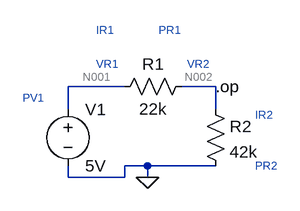
[diagram p0: schematic Draft14.asc]
Draft14.asc, the LTspice schematic file:
Version 4
SHEET 1 880 680
WIRE 176 96 96 96
WIRE 304 96 256 96
WIRE 96 128 96 96
WIRE 304 128 304 96
WIRE 208 208 176 208
WIRE 304 208 208 208
WIRE 96 224 96 208
WIRE 176 224 176 208
WIRE 176 224 96 224
WIRE 208 224 208 208
FLAG 208 224 0
DATAFLAG 288 96 "round(V(n002)*100)/100"
DATAFLAG 416 176 "round(I(R2)*100000)/100000"
DATAFLAG 384 240 "round(I(R2)*V(n002)*10000)/10000"
DATAFLAG 160 96 "(round(($-V(n002))*100)/100)*1"
DATAFLAG 144 48 "round(I(R1)*100000)/-100000"
DATAFLAG 240 48 "round(I(R1)*(V(n001)-V(n002))*10000)/-10000"
DATAFLAG 48 144 "round(I(V1)*V(n001)*10000)/10000"
SYMBOL res 272 80 R90
WINDOW 0 0 56 VBottom 2
WINDOW 3 32 56 VTop 2
SYMATTR InstName R1
SYMATTR Value 22k
SYMBOL voltage 96 112 R0
WINDOW 123 0 0 Left 0
WINDOW 39 0 0 Left 0
SYMATTR InstName V1
SYMATTR Value 5V
SYMBOL res 288 112 R0
SYMATTR InstName R2
SYMATTR Value 42k
TEXT 304 96 Left 2 !.op
TEXT 264 64 Left 1 ;VR2
TEXT 360 136 Left 1 ;IR2
TEXT 360 208 Left 1 ;PR2
TEXT 224 16 Left 1 ;PR1
TEXT 136 16 Left 1 ;IR1
TEXT 136 64 Left 1 ;VR1
TEXT 32 112 Left 1 ;PV1

The netlist it stands for:
* Draft14.asc
R1 N002 N001 22k
V1 N001 0 5V
R2 N002 0 42k
.op
* VR2
* IR2
* PR2
* PR1
* IR1
* VR1
* PV1
.backanno
.end

* Results of the author's LTspice run, read from the files saved beside the schematic
* Operating Point:
*   V(n002) = 3.281 V
*   V(n001) = 5 V
*   I(R2) = 78.12 µA
*   I(R1) = -78.12 µA
*   I(V1) = -78.12 µA